# EAGLE design Honigtopf_Steuerung (EAGLE 7.6.0)
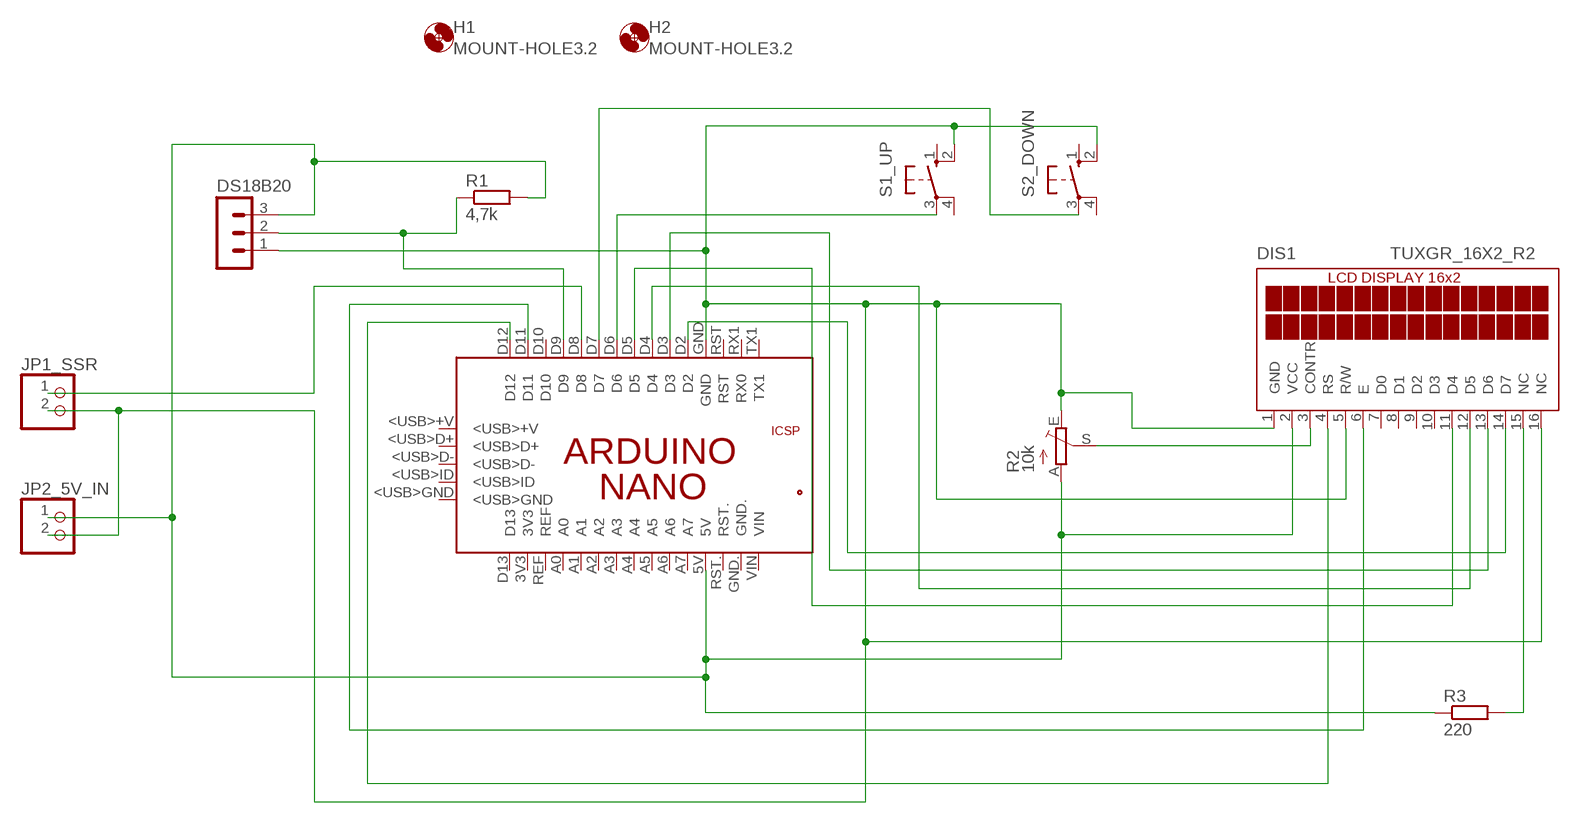
[diagram p0: schematic, sheet 1]

## Parts
DIS1  TUXGR_16X2_R2  [TUXGR_16X2_R2]
DS18B20  MA03-1  [MA03-1]
H1  MOUNT-HOLE3.2  [3,2]
H2  MOUNT-HOLE3.2  [3,2]
JP1_SSR  PINHD-1X2  [1X02]
JP2_5V_IN  PINHD-1X2  [1X02]
PCB1  ARDUINO_NANO  [ARDUINO_NANO]
R1  4,7k  R-EU_0411/15  [0411/15]
R2  10k  TRIM_EU-CA14V  [CA14V]
R3  220  R-EU_0411/15  [0411/15]
S1_UP  10-XX  [B3F-10XX]
S2_DOWN  10-XX  [B3F-10XX]

## Nets
5V: DIS1.2(VCC) DS18B20.3 JP2_5V_IN.1 PCB1.5V R1.2 R2.A R3.1
GND: DIS1.1(GND) DIS1.5(R/W) DIS1.16(NC) DS18B20.1 JP1_SSR.2 JP2_5V_IN.2 PCB1.GND R2.E S1_UP.2(S1) S2_DOWN.2(S1)
N$1: DS18B20.2 PCB1.D9 R1.1
N$2: DIS1.15(NC) R3.2
N$3: JP1_SSR.1 PCB1.D8
N$4: PCB1.D6 S1_UP.3(P)
N$5: PCB1.D7 S2_DOWN.3(P)
N$8: DIS1.3(CONTR) R2.S
N$9: DIS1.4(RS) PCB1.D12
N$11: DIS1.6(E) PCB1.D11
N$12: DIS1.11(D4) PCB1.D5
N$13: DIS1.12(D5) PCB1.D4
N$14: DIS1.13(D6) PCB1.D3
N$15: DIS1.14(D7) PCB1.D2
Unconnected: DIS1.7(D0) DIS1.8(D1) DIS1.9(D2) DIS1.10(D3) PCB1.3V3 PCB1.5V. PCB1.<USB>+V PCB1.<USB>D+ PCB1.<USB>D- PCB1.<USB>GND PCB1.<USB>ID PCB1.A0 PCB1.A1 PCB1.A2 PCB1.A3 PCB1.A4 PCB1.A5 PCB1.A6 PCB1.A7 PCB1.D10 PCB1.D13 PCB1.GND. PCB1.GND_ PCB1.MISO PCB1.MOSI PCB1.REF PCB1.RESET.. PCB1.RST PCB1.RST. PCB1.RX1(RX0) PCB1.SCK PCB1.TX1 PCB1.VIN S1_UP.1(S) S1_UP.4(P1) S2_DOWN.1(S) S2_DOWN.4(P1)

## Library data of the parts
DIS1 = display-lcd:TUXGR_16X2_R2: Tuxgraphics LCD display 16x2 characters reflective, without background light Source: tuxgr_12x2_r2.pdf; OC_FARNELL: unknown; OC_NEWARK: unknown
DS18B20 = con-lstb:MA03-1: PIN HEADER; OC_FARNELL: unknown; OC_NEWARK: unknown
H1 H2 = holes:MOUNT-HOLE: MOUNTING HOLE with drill center marker
JP1_SSR JP2_5V_IN = pinhead:PINHD-1X2: PIN HEADER
PCB1 = E14_Arduino_published:ARDUINO_NANO: Device for representing an Arduino Nano board with a footprint in an EAGLE design. Created by Dave Young for Element14. More EAGLE documentation at: http://www.element14.com/community/community/knode/cadsoft_eagle
R1 R3 = resistor:R-EU_: RESISTOR, European symbol
R2 = pot:TRIM_EU-: POTENTIOMETER
S1_UP S2_DOWN = switch-omron:10-XX: OMRON SWITCH; MPN: B3F-1000; OC_FARNELL: 176432; OC_NEWARK: 36M3542

## Board
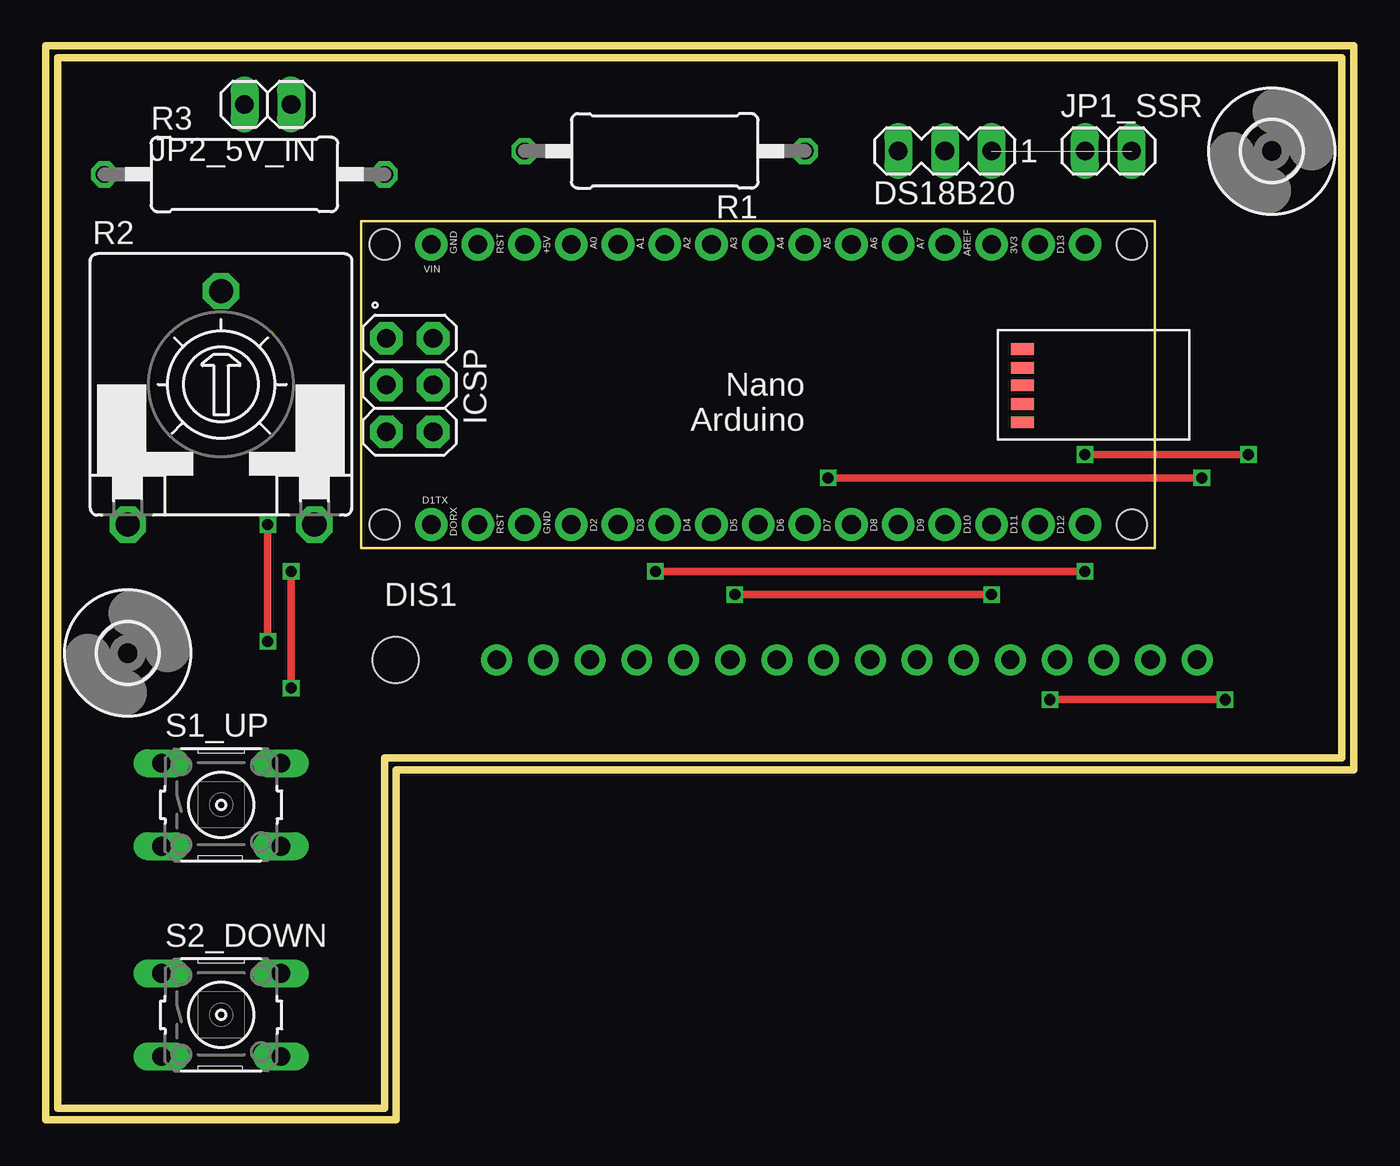
[diagram p1: board, top side]
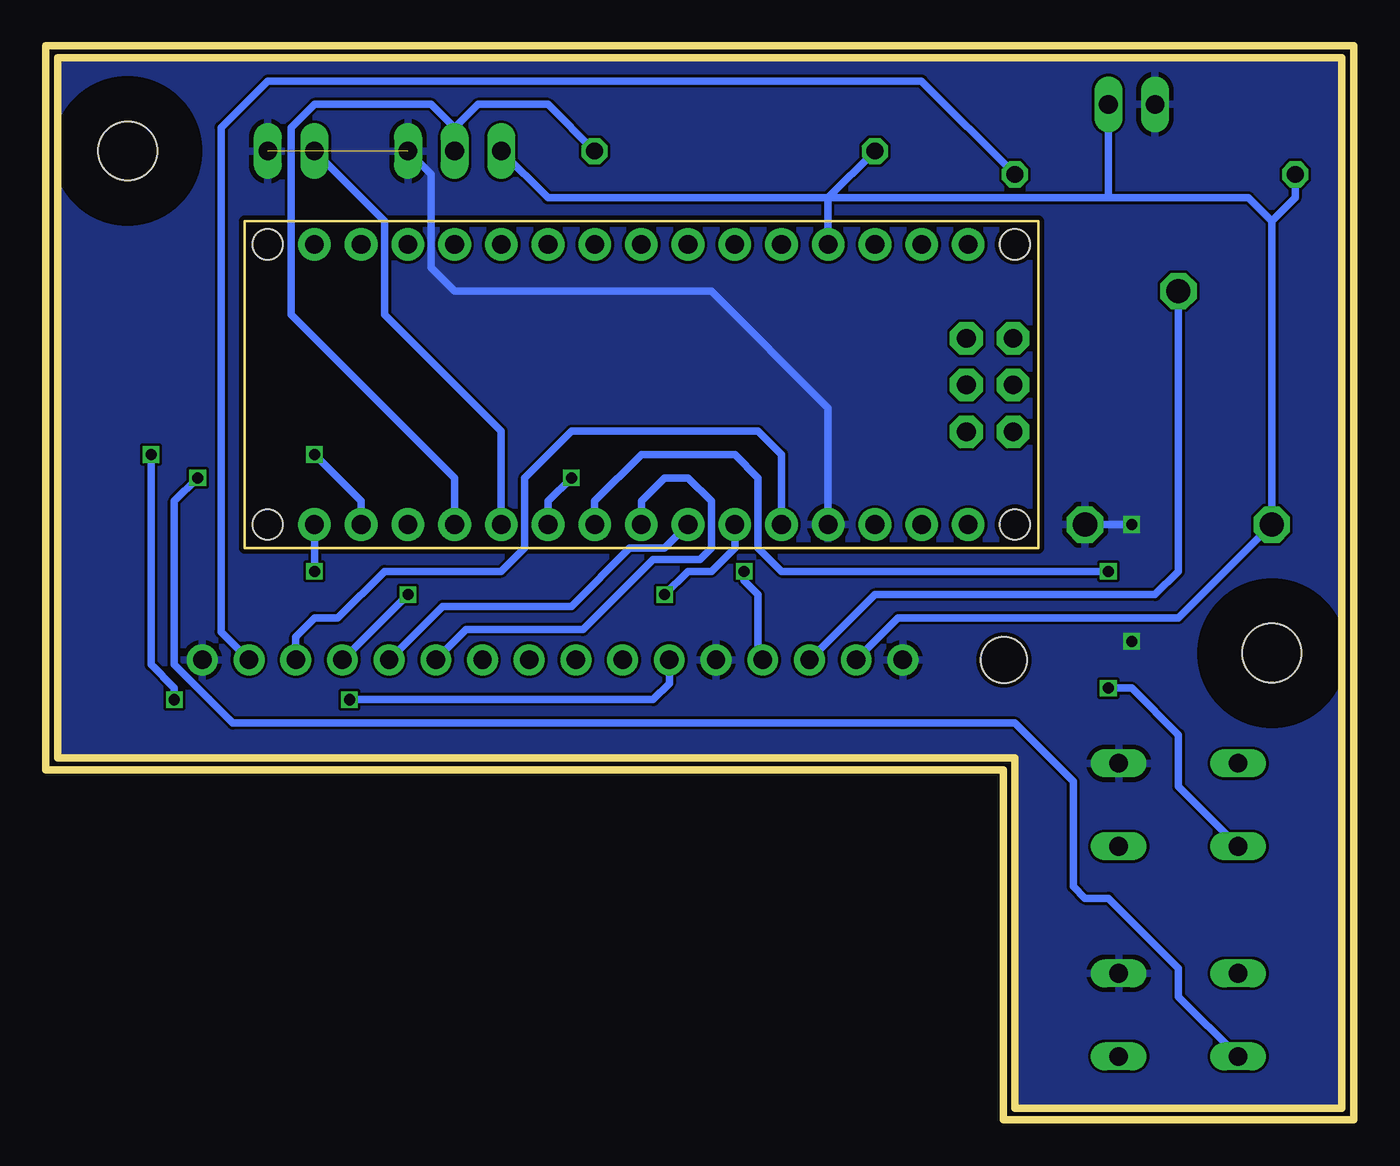
[diagram p2: board, bottom side, seen from below]

Size 71.12 x 58.42 mm. Coordinates in mm from the lower left corner, seen from the top.
Outline: 0,58.42 71.12,58.42 71.12,19.05 19.05,19.05 19.05,0 0,0 0,58.42
Copper layers (1*16): Top 0.035mm / dielectric 1.5mm / Bottom 0.035mm
Design rules "SeeedStudio_2layer_DRU_no_angle_20140221": minimum track width 6mil, minimum drill 12mil, track to track 6mil, track to pad 6mil, pad to pad 6mil, via to via 6mil, smd to smd 0mil, copper to edge 10mil, drill to drill 10mil, minimum pad ring 10mil, minimum via ring 6mil, stop-mask expansion 2mil, vias tented up to drill 100mil, thermal gap 10mil
Milling: 6 lines

### Footprints (pad centres in the part's own frame; a part is rotated, then mirrored left to right if it is on the bottom)
TUXGR_16X2_R2 = drill 1 pad 1.676: 1 -32,15.5; 2 -29.46,15.5; 3 -26.92,15.5; 4 -24.38,15.5; 5 -21.84,15.5; 6 -19.3,15.5; 7 -16.76,15.5; 8 -14.22,15.5; 9 -11.68,15.5; 10 -9.14,15.5; 11 -6.6,15.5; 12 -4.06,15.5; 13 -1.52,15.5; 14 1.02,15.5; 15 3.56,15.5; 16 6.1,15.5 | hole 2.5: -37.5,15.5
MA03-1 = drill 1.016 long: 1 -2.54,0; 2 0,0; 3 2.54,0
3,2 = hole 3.2: 0,0
1X02 = drill 1.016 long: 1 -1.27,0; 2 1.27,0
ARDUINO_NANO = drill 1.016 pad 1.778: 3V3 6.35,1.27; 5V 31.75,1.27; A0 11.43,1.27; A1 13.97,1.27; A2 16.51,1.27; A3 19.05,1.27; A4 21.59,1.27; A5 24.13,1.27; A6 26.67,1.27; A7 29.21,1.27; D2 29.21,16.51; D3 26.67,16.51; D4 24.13,16.51; D5 21.59,16.51; D6 19.05,16.51; D7 16.51,16.51; D8 13.97,16.51; D9 11.43,16.51; D10 8.89,16.51; D11 6.35,16.51; D12 3.81,16.51; D13 3.81,1.27; GND 31.75,16.51; GND. 36.83,1.27; REF 8.89,1.27; RST 34.29,16.51; RST. 34.29,1.27; RX1 36.83,16.51; TX1 39.37,16.51; VIN 39.37,1.27 | drill 1.016 pad 1.778 octagon: 5V. 39.268,6.375; GND_ 39.268,11.455; MISO 41.808,6.375; MOSI 39.268,8.915; RESET.. 41.808,11.455; SCK 41.808,8.915 | smd 1.27 x 0.635: <USB>+V 7.214,10.947; <USB>D+ 7.214,9.957; <USB>D- 7.214,8.941; <USB>GND 7.214,6.96; <USB>ID 7.214,7.976 | hole 1.651: 1.27,1.27; 1.27,16.51; 41.91,16.51; 41.91,1.27
0411/15 = drill 0.914 octagon: 1 -7.62,0; 2 7.62,0
CA14V = drill 1.321 octagon: A -5.08,-7.62; E 5.08,-7.62; S 0,5.08
B3F-10XX = drill 1.016 long: 1 -3.251,2.261; 2 3.251,2.261; 3 -3.251,-2.261; 4 3.251,-2.261

### Placement (x,y rotation side)
DIS1  56.52,9.52 0 top
DS18B20  48.9,52.71 180 top
H1  4.45,25.4 0 top
H2  66.67,52.71 0 top
JP1_SSR  57.79,52.71 0 top
JP2_5V_IN  12.06,55.24 180 top
PCB1  60.33,48.9 180 top
R1  33.66,52.71 180 top
R2  9.53,40 0 top
R3  10.79,51.43 0 top
S1_UP  9.53,17.14 0 top
S2_DOWN  9.53,5.71 0 top

### Tracks (layer width: path | path; a pad name or v marks a point on that pad's centre or on a via)
5V
  Bottom 0.406: 4.45,48.9 R2.A 9.53,27.3 24.78,27.3 DIS1.2 | DS18B20.3 43.81,50.16 28.58,50.16 | 28.58,50.16 R1.2 | PCB1.5V 28.58,50.16 | 28.58,50.16 13.33,50.16 | 13.33,50.16 5.71,50.16 4.45,48.9 | R3.1 3.17,50.16 4.45,48.9 | JP2_5V_IN.1 13.33,50.16
GND  (via drill 0.6)  (1 unrouted)
  Top 0.406: v12.06,32.38 v12.06,26.03
  Bottom 0.406: PCB1.GND 28.58,38.73 34.93,45.09 48.9,45.09 50.16,46.35 50.16,51.43 DS18B20.1 | R2.E v12.06,32.38
  pour Bottom: 0.64,57.79 70.48,57.79 70.48,19.68 18.42,19.68 18.42,0.63 0.64,0.63
N$1
  Bottom 0.406: R1.1 43.81,55.24 47.62,55.24 48.9,53.98 | DS18B20.2 48.9,53.98 | 48.9,53.98 50.16,55.24 56.52,55.24 57.79,53.98 57.79,43.82 48.9,34.92 PCB1.D9
N$2
  Bottom 0.406: R3.2 23.5,56.51 59.05,56.51 61.59,53.98 61.59,26.55 DIS1.15
N$3
  Bottom 0.406: JP1_SSR.1 52.7,48.9 52.7,43.82 46.36,37.46 PCB1.D8
N$4  (via drill 0.6)
  Top 0.406: v13.33,29.84 v13.33,23.49
  Bottom 0.406: PCB1.D6 41.27,33.66 38.73,36.2 33.66,36.2 32.38,34.92 32.38,31.12 31.12,29.84 v13.33,29.84 | v13.33,23.49 12.06,23.49 9.53,20.95 9.53,18.14 S1_UP.3
N$5  (via drill 0.6)
  Top 0.406: v42.55,34.92 v62.87,34.92
  Bottom 0.406: PCB1.D7 43.81,33.66 v42.55,34.92 | S2_DOWN.3 9.53,6.71 9.53,8.25 13.33,12.06 14.6,12.06 15.24,12.7 15.24,18.41 18.42,21.59 60.96,21.59 64.13,24.77 64.13,33.66 v62.87,34.92
N$8
  Bottom 0.406: R2.S 9.53,29.84 10.79,28.57 26.05,28.57 DIS1.3
N$9  (via drill 0.6)
  Top 0.406: v56.52,29.84 v33.14,29.84
  Bottom 0.406: PCB1.D12 v56.52,29.84 | v33.14,29.84 33.14,29.34 32.38,28.57 32.38,25.27 DIS1.4
N$11  (via drill 0.6)
  Top 0.406: v54.61,22.86 v64.13,22.86 | v65.41,36.2 v56.52,36.2
  Bottom 0.406: DIS1.6 37.22,23.74 38.1,22.86 v54.61,22.86 | v64.13,22.86 64.13,23.49 65.41,24.77 v65.41,36.2 | v56.52,36.2 53.98,33.66 PCB1.D11
N$12
  Bottom 0.406: PCB1.D5 38.73,33.66 37.47,34.92 36.2,34.92 34.93,33.66 34.93,31.12 35.56,30.48 38.1,30.48 41.91,26.67 48.27,26.67 DIS1.11
N$13
  Bottom 0.406: PCB1.D4 37.47,31.12 39.37,31.12 42.55,27.94 49.54,27.94 DIS1.12
N$14  (via drill 0.6)
  Top 0.406: v37.47,28.57 v51.44,28.57
  Bottom 0.406: PCB1.D3 33.66,31.12 34.93,29.84 36.2,29.84 v37.47,28.57 | DIS1.13 v51.44,28.57
N$15
  Bottom 0.406: DIS1.14 57.54,26.28 56.52,27.3 55.25,27.3 52.7,29.84 46.36,29.84 45.09,31.12 45.09,34.92 42.55,37.46 32.38,37.46 31.12,36.2 PCB1.D2